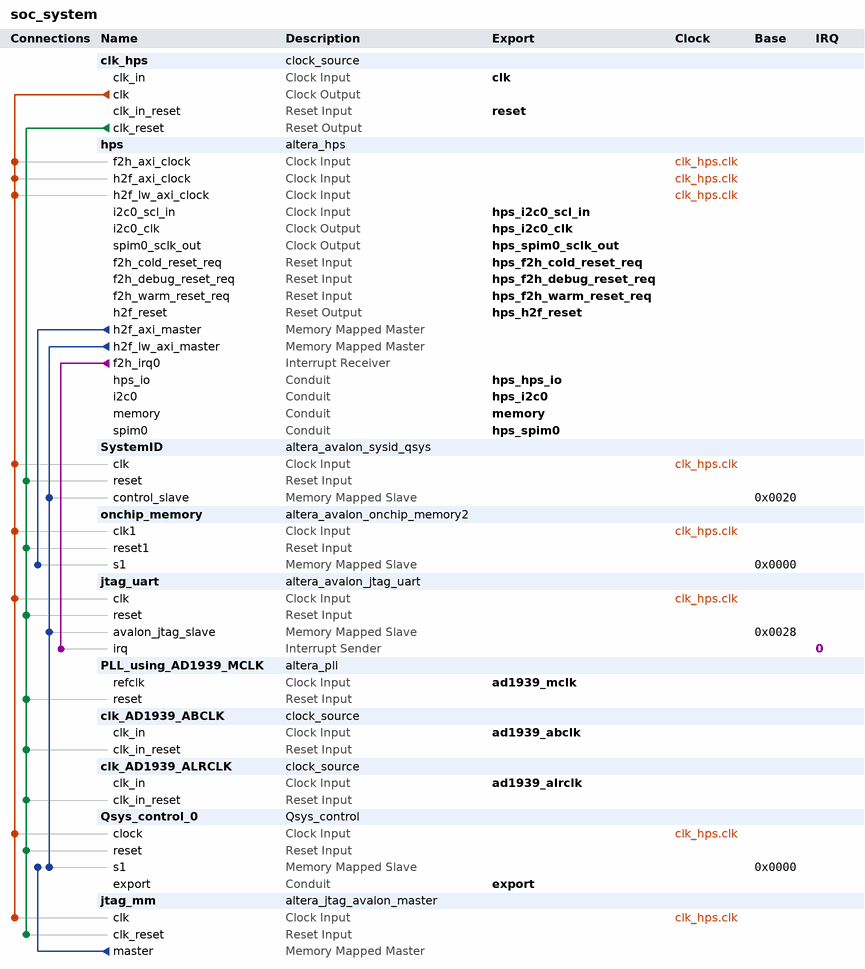
[diagram p0: system contents]
# Platform Designer (Qsys) system soc_system, Cyclone V 5CSEBA6U23I7
# Parameters at their usual value, and those the tool derives, are not listed.
package require -exact qsys 18.1
create_system soc_system
set_project_property DEVICE_FAMILY {Cyclone V}
set_project_property DEVICE 5CSEBA6U23I7

add_instance clk_hps clock_source 18.1
set_instance_parameter_value clk_hps clockFrequency 50000000

add_instance hps altera_hps 18.1
set_instance_parameter_value hps EMAC1_Mode RGMII
set_instance_parameter_value hps EMAC1_PinMuxing {HPS I/O Set 0}
set_instance_parameter_value hps F2SCLK_COLDRST_Enable true
set_instance_parameter_value hps F2SCLK_DBGRST_Enable true
set_instance_parameter_value hps F2SCLK_WARMRST_Enable true
set_instance_parameter_value hps F2SINTERRUPT_Enable true
set_instance_parameter_value hps F2S_Width 3
set_instance_parameter_value hps FPGA_PERIPHERAL_OUTPUT_CLOCK_FREQ_EMAC0_GTX_CLK 100
set_instance_parameter_value hps FPGA_PERIPHERAL_OUTPUT_CLOCK_FREQ_EMAC0_MD_CLK 100.0
set_instance_parameter_value hps FPGA_PERIPHERAL_OUTPUT_CLOCK_FREQ_EMAC1_GTX_CLK 100
set_instance_parameter_value hps FPGA_PERIPHERAL_OUTPUT_CLOCK_FREQ_EMAC1_MD_CLK 100.0
set_instance_parameter_value hps FPGA_PERIPHERAL_OUTPUT_CLOCK_FREQ_SPIM0_SCLK_OUT 1
set_instance_parameter_value hps HPS_PROTOCOL DDR3
set_instance_parameter_value hps I2C0_Mode Full
set_instance_parameter_value hps I2C0_PinMuxing FPGA
set_instance_parameter_value hps I2C1_Mode I2C
set_instance_parameter_value hps I2C1_PinMuxing {HPS I/O Set 0}
set_instance_parameter_value hps LWH2F_Enable true
set_instance_parameter_value hps MEM_BANKADDR_WIDTH 3
set_instance_parameter_value hps MEM_CLK_FREQ 400.0
set_instance_parameter_value hps MEM_COL_ADDR_WIDTH 10
set_instance_parameter_value hps MEM_DQ_WIDTH 32
set_instance_parameter_value hps MEM_DRV_STR RZQ/6
set_instance_parameter_value hps MEM_ROW_ADDR_WIDTH 15
set_instance_parameter_value hps MEM_RTT_NOM RZQ/6
set_instance_parameter_value hps MEM_RTT_WR {Dynamic ODT off}
set_instance_parameter_value hps MEM_TCL 7
set_instance_parameter_value hps MEM_TFAW_NS 37.5
set_instance_parameter_value hps MEM_TRAS_NS 35.0
set_instance_parameter_value hps MEM_TRCD_NS 13.75
set_instance_parameter_value hps MEM_TRFC_NS 300.0
set_instance_parameter_value hps MEM_TRP_NS 13.75
set_instance_parameter_value hps MEM_VENDOR Other
set_instance_parameter_value hps MEM_WTCL 7
set_instance_parameter_value hps QSPI_Mode N/A
set_instance_parameter_value hps QSPI_PinMuxing Unused
set_instance_parameter_value hps REF_CLK_FREQ 25.0
set_instance_parameter_value hps S2FCLK_COLDRST_Enable true
set_instance_parameter_value hps S2FCLK_USER2CLK 5
set_instance_parameter_value hps S2F_Width 2
set_instance_parameter_value hps SDIO_Mode {4-bit Data}
set_instance_parameter_value hps SDIO_PinMuxing {HPS I/O Set 0}
set_instance_parameter_value hps SPIM0_Mode Full
set_instance_parameter_value hps SPIM0_PinMuxing FPGA
set_instance_parameter_value hps SPIM1_Mode {Single Slave Select}
set_instance_parameter_value hps SPIM1_PinMuxing {HPS I/O Set 0}
set_instance_parameter_value hps STM_Enable false
set_instance_parameter_value hps TIMING_BOARD_AC_SKEW 0.02
set_instance_parameter_value hps TIMING_BOARD_AC_TO_CK_SKEW 0.0
set_instance_parameter_value hps TIMING_BOARD_DQ_TO_DQS_SKEW 0.0
set_instance_parameter_value hps TIMING_BOARD_MAX_CK_DELAY 0.6
set_instance_parameter_value hps TIMING_BOARD_MAX_DQS_DELAY 0.6
set_instance_parameter_value hps TIMING_BOARD_SKEW_BETWEEN_DQS 0.02
set_instance_parameter_value hps TIMING_BOARD_SKEW_CKDQS_DIMM_MAX 0.01
set_instance_parameter_value hps TIMING_BOARD_SKEW_CKDQS_DIMM_MIN -0.01
set_instance_parameter_value hps TIMING_BOARD_SKEW_WITHIN_DQS 0.02
set_instance_parameter_value hps TIMING_TDH 125
set_instance_parameter_value hps TIMING_TDQSCK 400
set_instance_parameter_value hps TIMING_TDQSQ 120
set_instance_parameter_value hps TIMING_TDS 50
set_instance_parameter_value hps TIMING_TIH 250
set_instance_parameter_value hps TIMING_TIS 175
set_instance_parameter_value hps TIMING_TQSH 0.38
set_instance_parameter_value hps UART0_Mode {No Flow Control}
set_instance_parameter_value hps UART0_PinMuxing {HPS I/O Set 0}
set_instance_parameter_value hps USB1_Mode SDR
set_instance_parameter_value hps USB1_PinMuxing {HPS I/O Set 0}
set_instance_parameter_value hps desired_cfg_clk_mhz 100.0
set_instance_parameter_value hps desired_qspi_clk_mhz 370.0

add_instance SystemID altera_avalon_sysid_qsys 18.1
set_instance_parameter_value SystemID id -1395322110

add_instance onchip_memory altera_avalon_onchip_memory2 18.1
set_instance_parameter_value onchip_memory dataWidth 64
set_instance_parameter_value onchip_memory dualPort false
set_instance_parameter_value onchip_memory initMemContent true
set_instance_parameter_value onchip_memory initializationFileName onchip_memory2_0
set_instance_parameter_value onchip_memory memorySize 65536

add_instance jtag_uart altera_avalon_jtag_uart 18.1
set_instance_parameter_value jtag_uart allowMultipleConnections true
set_instance_parameter_value jtag_uart simInteractiveOptions INTERACTIVE_ASCII_OUTPUT

add_instance PLL_using_AD1939_MCLK altera_pll 18.1
set_instance_parameter_value PLL_using_AD1939_MCLK gui_device_speed_grade 2
set_instance_parameter_value PLL_using_AD1939_MCLK gui_number_of_clocks 1
set_instance_parameter_value PLL_using_AD1939_MCLK gui_operation_mode direct
set_instance_parameter_value PLL_using_AD1939_MCLK gui_output_clock_frequency0 98.304
set_instance_parameter_value PLL_using_AD1939_MCLK gui_pll_mode {Integer-N PLL}
set_instance_parameter_value PLL_using_AD1939_MCLK gui_reference_clock_frequency 12.288
set_instance_parameter_value PLL_using_AD1939_MCLK gui_use_locked false

add_instance clk_AD1939_ABCLK clock_source 18.1
set_instance_parameter_value clk_AD1939_ABCLK clockFrequency 12288000

add_instance clk_AD1939_ALRCLK clock_source 18.1
set_instance_parameter_value clk_AD1939_ALRCLK clockFrequency 192000

add_instance Qsys_control_0 Qsys_control 1.0

add_instance jtag_mm altera_jtag_avalon_master 18.1

# connections
add_connection clk_hps.clk hps.f2h_axi_clock clock
add_connection clk_hps.clk hps.h2f_axi_clock clock
add_connection clk_hps.clk hps.h2f_lw_axi_clock clock
add_connection clk_hps.clk jtag_mm.clk clock
add_connection clk_hps.clk jtag_uart.clk clock
add_connection clk_hps.clk onchip_memory.clk1 clock
add_connection clk_hps.clk Qsys_control_0.clock clock
add_connection clk_hps.clk SystemID.clk clock
add_connection clk_hps.clk_reset clk_AD1939_ABCLK.clk_in_reset reset
add_connection clk_hps.clk_reset clk_AD1939_ALRCLK.clk_in_reset reset
add_connection clk_hps.clk_reset jtag_mm.clk_reset reset
add_connection clk_hps.clk_reset jtag_uart.reset reset
add_connection clk_hps.clk_reset onchip_memory.reset1 reset
add_connection clk_hps.clk_reset PLL_using_AD1939_MCLK.reset reset
add_connection clk_hps.clk_reset Qsys_control_0.reset reset
add_connection clk_hps.clk_reset SystemID.reset reset
add_connection hps.h2f_axi_master onchip_memory.s1 avalon
set_connection_parameter_value hps.h2f_axi_master/onchip_memory.s1 baseAddress 0x0000
add_connection hps.h2f_lw_axi_master jtag_uart.avalon_jtag_slave avalon
set_connection_parameter_value hps.h2f_lw_axi_master/jtag_uart.avalon_jtag_slave baseAddress 0x0028
add_connection hps.h2f_lw_axi_master Qsys_control_0.s1 avalon
set_connection_parameter_value hps.h2f_lw_axi_master/Qsys_control_0.s1 baseAddress 0x0000
add_connection hps.h2f_lw_axi_master SystemID.control_slave avalon
set_connection_parameter_value hps.h2f_lw_axi_master/SystemID.control_slave baseAddress 0x0020
add_connection jtag_mm.master Qsys_control_0.s1 avalon
set_connection_parameter_value jtag_mm.master/Qsys_control_0.s1 baseAddress 0x0000
add_connection hps.f2h_irq0 jtag_uart.irq interrupt
set_connection_parameter_value hps.f2h_irq0/jtag_uart.irq irqNumber 0

# exported interfaces
add_interface ad1939_abclk clock sink
set_interface_property ad1939_abclk EXPORT_OF clk_AD1939_ABCLK.clk_in
add_interface ad1939_alrclk clock sink
set_interface_property ad1939_alrclk EXPORT_OF clk_AD1939_ALRCLK.clk_in
add_interface ad1939_mclk clock sink
set_interface_property ad1939_mclk EXPORT_OF PLL_using_AD1939_MCLK.refclk
add_interface clk clock sink
set_interface_property clk EXPORT_OF clk_hps.clk_in
add_interface export conduit end
set_interface_property export EXPORT_OF Qsys_control_0.export
add_interface hps_f2h_cold_reset_req reset sink
set_interface_property hps_f2h_cold_reset_req EXPORT_OF hps.f2h_cold_reset_req
add_interface hps_f2h_debug_reset_req reset sink
set_interface_property hps_f2h_debug_reset_req EXPORT_OF hps.f2h_debug_reset_req
add_interface hps_f2h_warm_reset_req reset sink
set_interface_property hps_f2h_warm_reset_req EXPORT_OF hps.f2h_warm_reset_req
add_interface hps_h2f_reset reset source
set_interface_property hps_h2f_reset EXPORT_OF hps.h2f_reset
add_interface hps_hps_io conduit end
set_interface_property hps_hps_io EXPORT_OF hps.hps_io
add_interface hps_i2c0 conduit end
set_interface_property hps_i2c0 EXPORT_OF hps.i2c0
add_interface hps_i2c0_clk clock source
set_interface_property hps_i2c0_clk EXPORT_OF hps.i2c0_clk
add_interface hps_i2c0_scl_in clock sink
set_interface_property hps_i2c0_scl_in EXPORT_OF hps.i2c0_scl_in
add_interface hps_spim0 conduit end
set_interface_property hps_spim0 EXPORT_OF hps.spim0
add_interface hps_spim0_sclk_out clock source
set_interface_property hps_spim0_sclk_out EXPORT_OF hps.spim0_sclk_out
add_interface memory conduit end
set_interface_property memory EXPORT_OF hps.memory
add_interface reset reset sink
set_interface_property reset EXPORT_OF clk_hps.clk_in_reset

set_interconnect_requirement {$system} qsys_mm.clockCrossingAdapter HANDSHAKE
set_interconnect_requirement {$system} qsys_mm.maxAdditionalLatency 1

save_system soc_system.qsys
